# Altium schematic sheet primary_decoupling.SchDoc: foxBMS BMS-Slave 12-Cell
size A3; DocumentNumber: 5; SheetNumber: 5; SheetTotal: 19; AUTHOR: Fraunhofer IISB foxBMS Team; SheetDescription: Primary Voltage Measurement
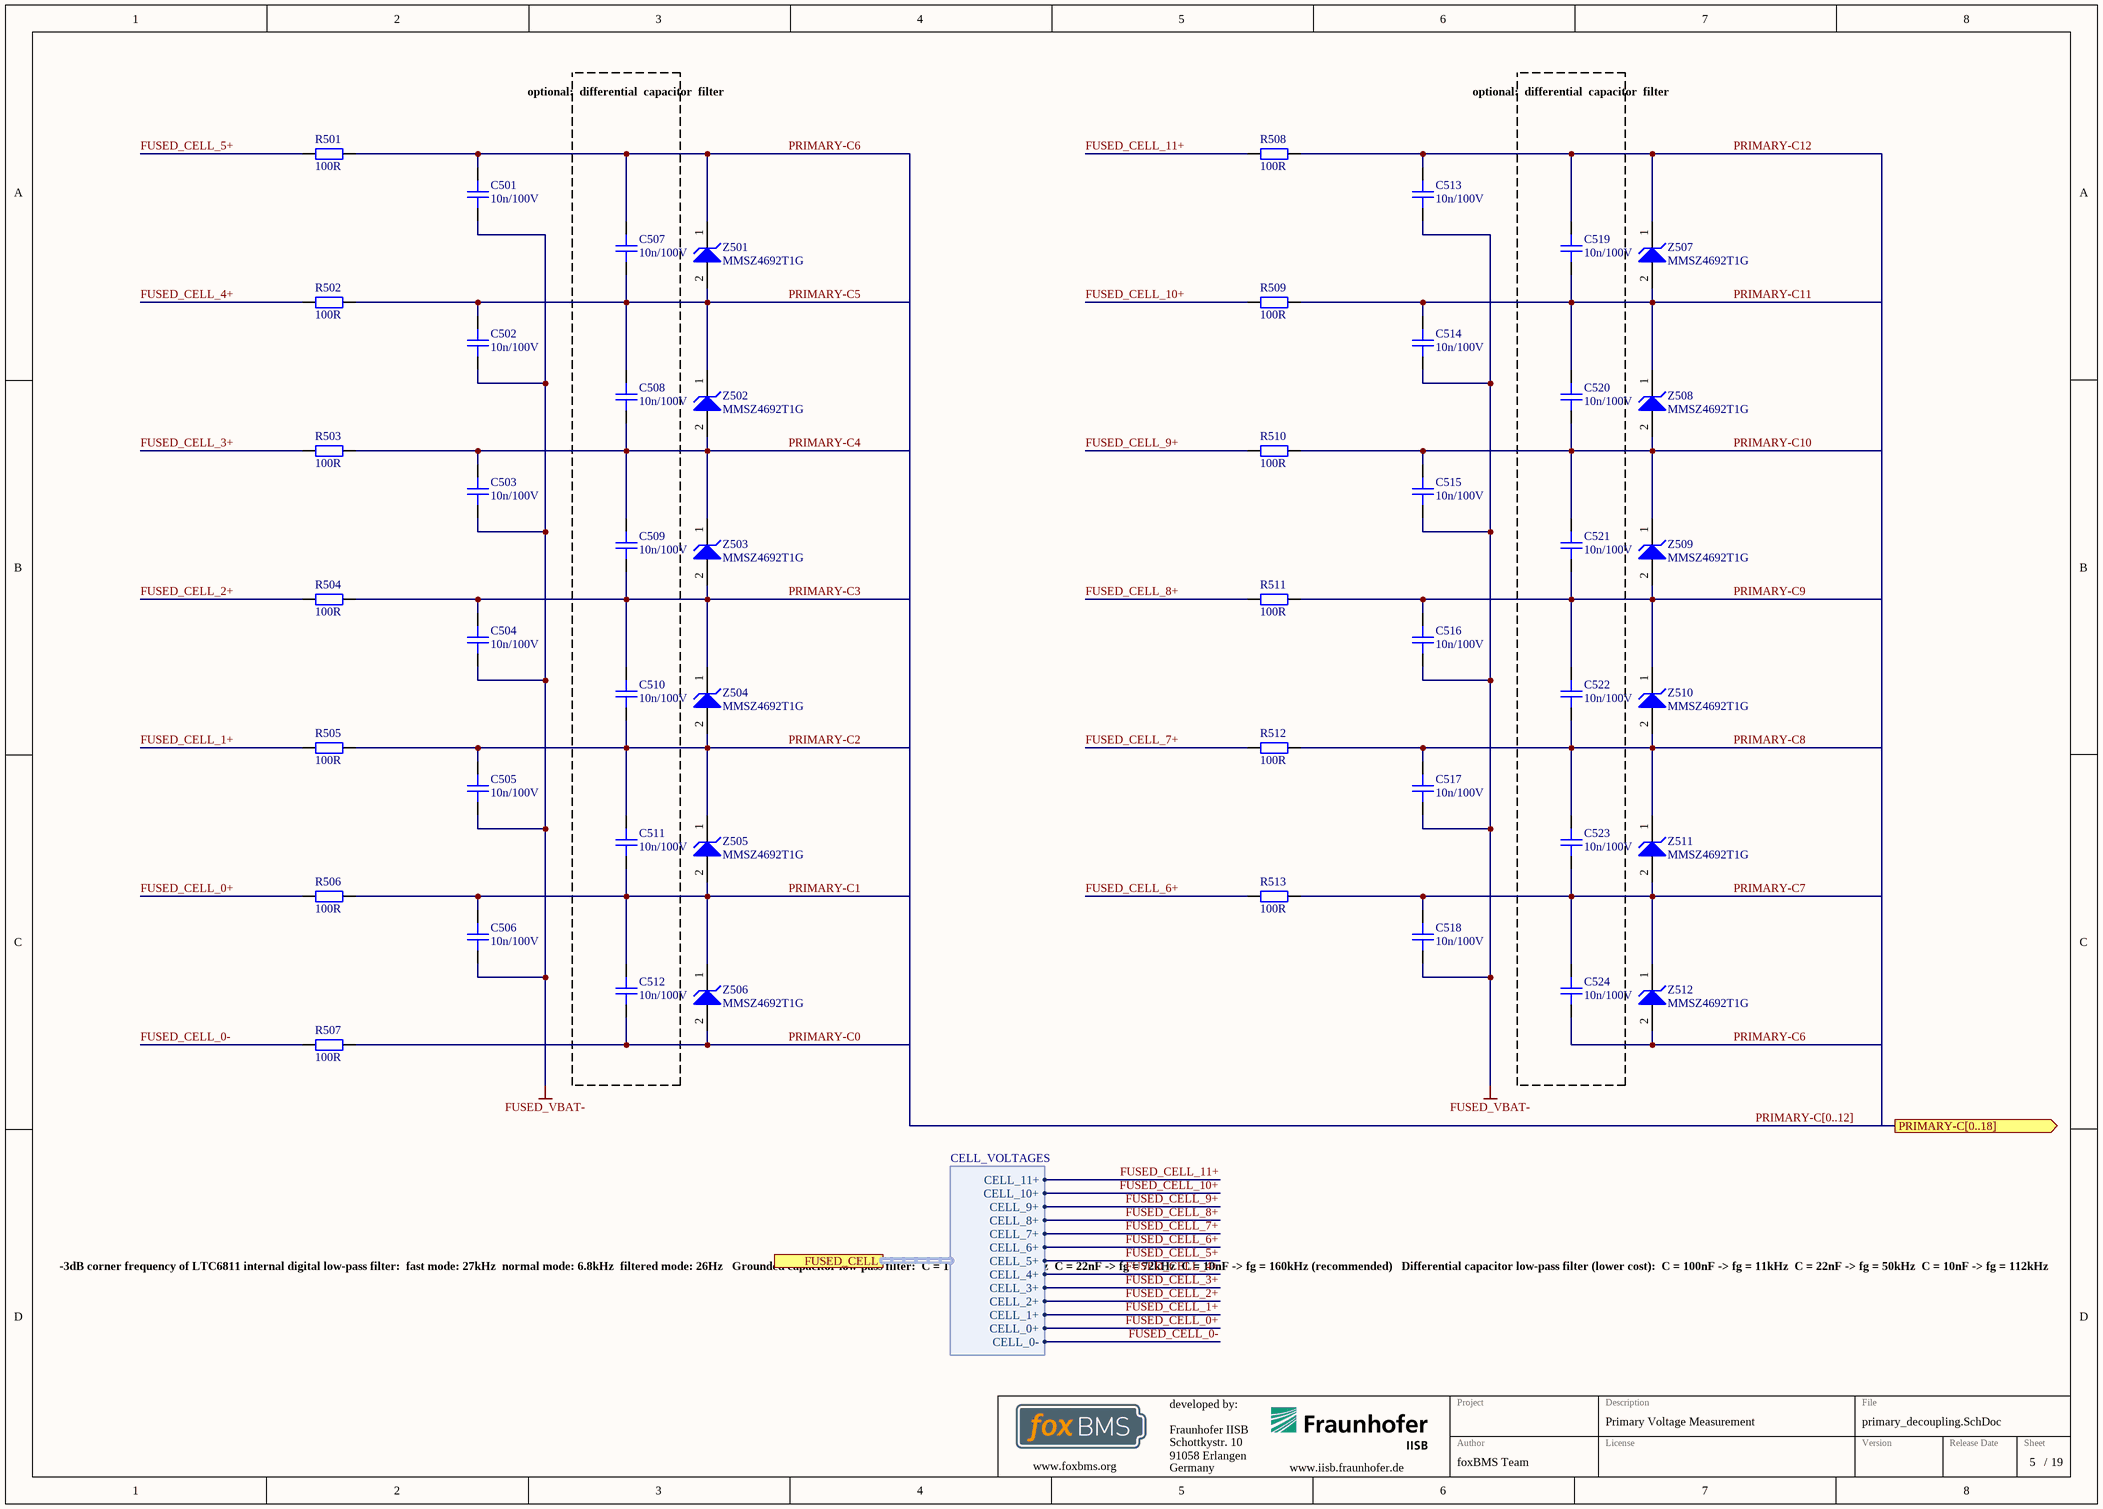
[diagram p0: primary_decoupling.SchDoc]

## Parts
C501  10n/100V  [CAPC1608X08N]
C502  10n/100V  [CAPC1608X08N]
C503  10n/100V  [CAPC1608X08N]
C504  10n/100V  [CAPC1608X08N]
C505  10n/100V  [CAPC1608X08N]
C506  10n/100V  [CAPC1608X08N]
C507  10n/100V  [CAPC1608X08N]
C508  10n/100V  [CAPC1608X08N]
C509  10n/100V  [CAPC1608X08N]
C510  10n/100V  [CAPC1608X08N]
C511  10n/100V  [CAPC1608X08N]
C512  10n/100V  [CAPC1608X08N]
C513  10n/100V  [CAPC1608X08N]
C514  10n/100V  [CAPC1608X08N]
C515  10n/100V  [CAPC1608X08N]
C516  10n/100V  [CAPC1608X08N]
C517  10n/100V  [CAPC1608X08N]
C518  10n/100V  [CAPC1608X08N]
C519  10n/100V  [CAPC1608X08N]
C520  10n/100V  [CAPC1608X08N]
C521  10n/100V  [CAPC1608X08N]
C522  10n/100V  [CAPC1608X08N]
C523  10n/100V  [CAPC1608X08N]
C524  10n/100V  [CAPC1608X08N]
R501  100R  [RESC1608X05N]
R502  100R  [RESC1608X05N]
R503  100R  [RESC1608X05N]
R504  100R  [RESC1608X05N]
R505  100R  [RESC1608X05N]
R506  100R  [RESC1608X05N]
R507  100R  [RESC1608X05N]
R508  100R  [RESC1608X05N]
R509  100R  [RESC1608X05N]
R510  100R  [RESC1608X05N]
R511  100R  [RESC1608X05N]
R512  100R  [RESC1608X05N]
R513  100R  [RESC1608X05N]
Z501  MMSZ4692T1G  [ONSC-SOD-123-2-425-04_V]
Z502  MMSZ4692T1G  [ONSC-SOD-123-2-425-04_V]
Z503  MMSZ4692T1G  [ONSC-SOD-123-2-425-04_V]
Z504  MMSZ4692T1G  [ONSC-SOD-123-2-425-04_V]
Z505  MMSZ4692T1G  [ONSC-SOD-123-2-425-04_V]
Z506  MMSZ4692T1G  [ONSC-SOD-123-2-425-04_V]
Z507  MMSZ4692T1G  [ONSC-SOD-123-2-425-04_V]
Z508  MMSZ4692T1G  [ONSC-SOD-123-2-425-04_V]
Z509  MMSZ4692T1G  [ONSC-SOD-123-2-425-04_V]
Z510  MMSZ4692T1G  [ONSC-SOD-123-2-425-04_V]
Z511  MMSZ4692T1G  [ONSC-SOD-123-2-425-04_V]
Z512  MMSZ4692T1G  [ONSC-SOD-123-2-425-04_V]

## Blocks framed on the sheet
optional: / differential / capacitor / filter: C507-C512
optional: / differential / capacitor / filter: C519-C524

## Ports
FUSED_CELL (harness CELL_VOLTAGES), PRIMARY-C[0..18] (out)

## Harnesses
CELL_VOLTAGES: CELL_0-, CELL_0+, CELL_1+, CELL_10+, CELL_11+, CELL_2+, CELL_3+, CELL_4+, CELL_5+, CELL_6+, CELL_7+, CELL_8+, CELL_9+

## Nets
FUSED_VBAT-: C501.2 C502.2 C503.2 C504.2 C505.2 C506.2 C513.2 C514.2 C515.2 C516.2 C517.2 C518.2
FUSED_CELL_0+: R506.1 ; port FUSED_CELL.CELL_0+
FUSED_CELL_0-: R507.1 ; port FUSED_CELL.CELL_0-
FUSED_CELL_1+: R505.1 ; port FUSED_CELL.CELL_1+
FUSED_CELL_2+: R504.1 ; port FUSED_CELL.CELL_2+
FUSED_CELL_3+: R503.1 ; port FUSED_CELL.CELL_3+
FUSED_CELL_4+: R502.1 ; port FUSED_CELL.CELL_4+
FUSED_CELL_5+: R501.1 ; port FUSED_CELL.CELL_5+
FUSED_CELL_6+: R513.1 ; port FUSED_CELL.CELL_6+
FUSED_CELL_7+: R512.1 ; port FUSED_CELL.CELL_7+
FUSED_CELL_8+: R511.1 ; port FUSED_CELL.CELL_8+
FUSED_CELL_9+: R510.1 ; port FUSED_CELL.CELL_9+
FUSED_CELL_10+: R509.1 ; port FUSED_CELL.CELL_10+
FUSED_CELL_11+: R508.1 ; port FUSED_CELL.CELL_11+
PRIMARY-C0: C512.2 R507.2 Z506.2(A)
PRIMARY-C1: C506.1 C511.2 C512.1 R506.2 Z505.2(A) Z506.1(K)
PRIMARY-C2: C505.1 C510.2 C511.1 R505.2 Z504.2(A) Z505.1(K)
PRIMARY-C3: C504.1 C509.2 C510.1 R504.2 Z503.2(A) Z504.1(K)
PRIMARY-C4: C503.1 C508.2 C509.1 R503.2 Z502.2(A) Z503.1(K)
PRIMARY-C5: C502.1 C507.2 C508.1 R502.2 Z501.2(A) Z502.1(K)
PRIMARY-C6: C501.1 C507.1 C524.2 R501.2 Z501.1(K) Z512.2(A)
PRIMARY-C7: C518.1 C523.2 C524.1 R513.2 Z511.2(A) Z512.1(K)
PRIMARY-C8: C517.1 C522.2 C523.1 R512.2 Z510.2(A) Z511.1(K)
PRIMARY-C9: C516.1 C521.2 C522.1 R511.2 Z509.2(A) Z510.1(K)
PRIMARY-C10: C515.1 C520.2 C521.1 R510.2 Z508.2(A) Z509.1(K)
PRIMARY-C11: C514.1 C519.2 C520.1 R509.2 Z507.2(A) Z508.1(K)
PRIMARY-C12: C513.1 C519.1 R508.2 Z507.1(K)

## Buses and harness runs
bus PRIMARY-C[0..12] = port PRIMARY-C[0..18]

## Notes on the sheet
- -3dB corner frequency of LTC6811 internal digital low-pass filter:
  fast mode: 27kHz
  normal mode: 6.8kHz
  filtered mode: 26Hz
  Grounded capacitor low-pass filter:
  C = 100nF -> fg = 16kHz
  C = 22nF -> fg = 72kHz
  C = 10nF -> fg = 160kHz (recommended)
  Differential capacitor low-pass filter (lower cost):
  C = 100nF -> fg = 11kHz
  C = 22nF -> fg = 50kHz
  C = 10nF -> fg = 112kHz
- Fraunhofer IISB
- Schottkystr. 10
- developed by:
- 91058 Erlangen
- Germany
- Author
- Project
- License
- Description
- File
- Version
- Release Date
- Sheet
- www.foxbms.org
- www.iisb.fraunhofer.de
- foxBMS Team
- /

## Library data of the parts
C501-C524 = gen_C_ceramic_10n_100V_X7R_0603: MLCC; Capacitance: 10n; Rated Voltage: 100V; Dielectric: X7R; Case EIA: 0603; Case Metric: 1608; Automotive Qualified: False; Part Number: gen_C_ceramic_10n_100V_X7R_0603; Supplier 1: Farnell; Supplier Part Number 1: 1865545
R501-R513 = gen_R_100R_0603: SMD Resistor 100R 0603; Tolerance: 1%; Power: 0.1W; Case EIA: 0603; Case Metric: 1608; Maximum Working Voltage: 75V; PnP Package: R_0603; Automotive Qualified: False; Part Number: gen_R_100R_0603; Operating Temperature: -55°C - +155°C; Resistance: 100R; Series: E24, E96; PnP Value: 100R; Supplier 1: Farnell; Supplier Part Number 1: 1469752
Z501-Z512 = CMP-1060-00434-1: Zener Voltage Regulator, 500 mW, 2-Pin SOD-123, Pb-Free, Tape and Reel; Manufacturer: On Semiconductor; VZ Typ (V): 6.8; P Max (W): 0.5; ComponentLink2URL: http://www.onsemi.com/pub_link/Collateral/MMSZ4678T1-D.PDF; Mounting Technology: Surface Mount; DatasheetVersion: Rev. 9; ComponentLink1Description: Manufacturer URL; ComponentLink3URL: http://www.onsemi.com/pub_link/Collateral/425-04.PDF; PackageReference: SOD-123-2-425-04; ComponentLink2Description: Datasheet; RoHS: Pb-Free; Packing: Tape and Reel; ComponentLink1URL: http://www.onsemi.com/; PackageDescription: 2-Pin SOD, Body 1.6 x 2.69 mm; ComponentLink3Description: Package Specification; PartNumber: MMSZ4692T1G; PackageVersion: Rev. G, 10/2009